# EAGLE design DCDC for Sensor 9V (EAGLE 7.6.0)
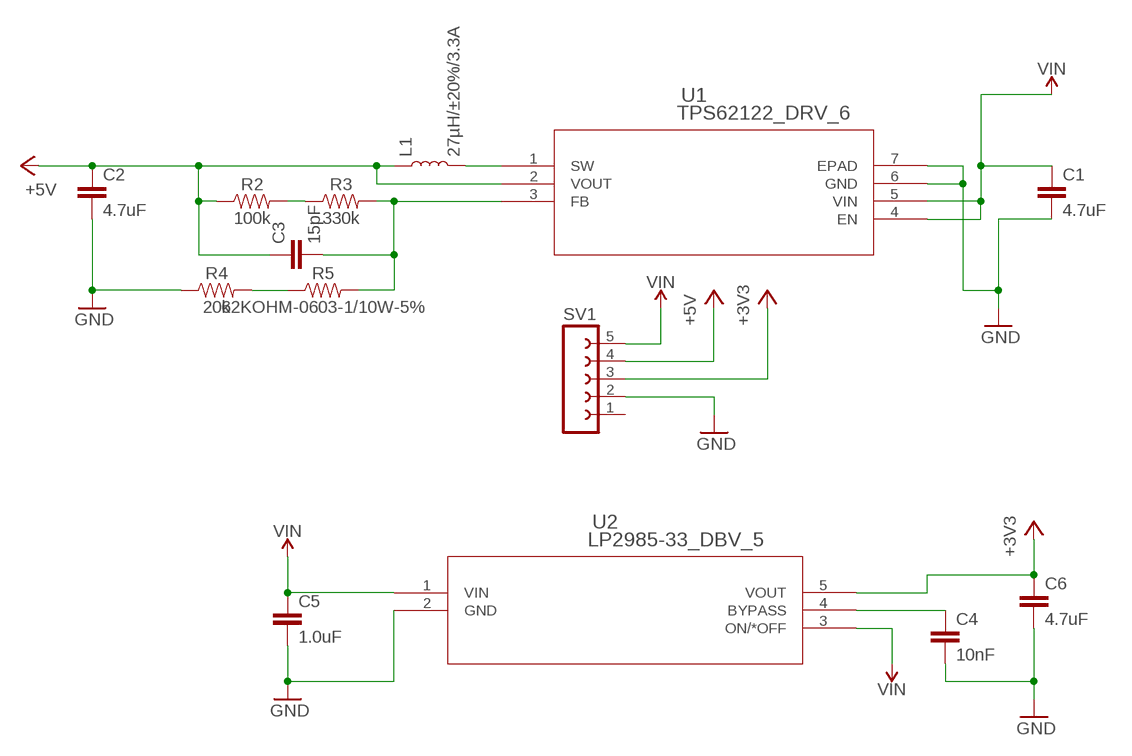
[diagram p0: schematic, sheet 1]

## Parts
C1  4.7uF  4.7UF-1206-16V-(+80/-20%)  [1206]
C2  4.7uF  4.7UF-1206-16V-(+80/-20%)  [1206]
C3  15pF  15PF-0603-50V-5%  [0603]
C4  10nF  10NF-0603-50V-10%  [0603]
C5  1.0uF  1.0UF-0603-16V-10%  [0603]
C6  4.7uF  4.7UF0603  [0603]
L1  27µH/±20%/3.3A  INDUCTOR-SDR13-27UH  [INDUCTOR_SDR1307]
R2  100k  100KOHM-0603-1/10W-1%  [0603]
R3  330k  330KOHM-0603-1/10W-1%  [0603]
R4  20k  20KOHM-0603-1/10W-5%  [0603]
R5  62KOHM-0603-1/10W-5%  [0603]
SV1  FE05-1  [FE05-1]
U1  TPS62122_DRV_6  [DRV6_1P6X1]
U2  LP2985-33_DBV_5  [DBV5]

## Nets
+3V3: C6.1 SV1.3 U2.5(VOUT)
+5V: C2.1 C3.1 L1.P$1 R2.1 SV1.4 U1.2(VOUT)
GND: C1.2 C2.2 C4.2 C5.2 C6.2 R4.1 SV1.2 U1.6(GND) U1.7(EPAD) U2.2(GND)
N$1: R4.2 R5.1
N$2: R2.2 R3.1
N$3: C4.1 U2.4(BYPASS)
N$4: L1.P$2 U1.1(SW)
N$7: C3.2 R3.2 R5.2 U1.3(FB)
VIN: C1.1 C5.1 SV1.5 U1.4(EN) U1.5(VIN) U2.1(VIN) U2.3(ON/*OFF)
Unconnected: SV1.1

## Library data of the parts
C1 C2 = SparkFun-Capacitors:4.7UF: 4.7µF ceramic capacitors A capacitor is a passive two-terminal electrical component used to store electrical energy temporarily in an electric field.; PROD_ID: CAP-10300
C3 = SparkFun-Capacitors:15PF: 15pF ceramic capacitors A capacitor is a passive two-terminal electrical component used to store electrical energy temporarily in an electric field.; PROD_ID: CAP-07881
C4 = SparkFun-Capacitors:10NF: 0.01uF/10nF/10,000pF ceramic capacitors A capacitor is a passive two-terminal electrical component used to store electrical energy temporarily in an electric field. CAP-09321; PROD_ID: CAP-00867
C5 = SparkFun-Capacitors:1.0UF: 1µF ceramic capacitors A capacitor is a passive two-terminal electrical component used to store electrical energy temporarily in an electric field.; PROD_ID: CAP-00868
C6 = SparkFun-Capacitors:4.7UF: 4.7µF ceramic capacitors A capacitor is a passive two-terminal electrical component used to store electrical energy temporarily in an electric field.; PROD_ID: CAP-08280
L1 = SparkFun-Coils:INDUCTOR: Inductors Resist changes in electrical current. Basically a coil of wire. SparkFun Products: SparkFun Load Cell Amplifier - HX711 <https://www.sparkfun.com/products/13879> IOIO-OTG - V2.2 <https://www.sparkfun.com/products/13613>; PROD_ID: NDUC-12529
R2 = SparkFun-Resistors:100KOHM: 100kΩ resistor A resistor is a passive two-terminal electrical component that implements electrical resistance as a circuit element. Resistors act to reduce current flow, and, at the same time, act to lower voltage levels within circuits. - Wikipedia; PROD_ID: RES-07828
R3 = SparkFun-Resistors:330KOHM: 330kΩ resistor A resistor is a passive two-terminal electrical component that implements electrical resistance as a circuit element. Resistors act to reduce current flow, and, at the same time, act to lower voltage levels within circuits. - Wikipedia; PROD_ID: RES-08968
R4 = SparkFun-Resistors:20KOHM: 20kΩ resistor A resistor is a passive two-terminal electrical component that implements electrical resistance as a circuit element. Resistors act to reduce current flow, and, at the same time, act to lower voltage levels within circuits. - Wikipedia; PROD_ID: RES-09231
R5 = SparkFun-Resistors:62KOHM: 62kΩ resistor A resistor is a passive two-terminal electrical component that implements electrical resistance as a circuit element. Resistors act to reduce current flow, and, at the same time, act to lower voltage levels within circuits. - Wikipedia
SV1 = con-lsta:FE05-1: FEMALE HEADER; OC_FARNELL: unknown; OC_NEWARK: unknown
U1 = TPS62122:TPS62122_DRV_6; DATASHEETURL: httpwww.ti.comlitgpnTPS62122; FAMILY_NAME: STEPDOWN REGULATOR; GENERIC_PART_NUMBER: TPS62122; INDUSTRY_STD_PKG_TYPE: SON; MANUFACTURER: Texas Instruments; MANUFACTURER_PART_NUMBER: tps62122_drv_6; PACKAGE_DESIGNATOR: DRV; PIN_COUNT: 6; VENDOR: Texas Instruments
U2 = LP298533:LP2985-33_DBV_5; DATASHEETURL: httpwww.ti.comlitgpnLP298533; FAMILY_NAME: SINGLE CHANNEL LDO; GENERIC_PART_NUMBER: LP298533; INDUSTRY_STD_PKG_TYPE: SOT23; MANUFACTURER: Texas Instruments; MANUFACTURER_PART_NUMBER: lp298533_dbv_5; PACKAGE_DESIGNATOR: DBV; PIN_COUNT: 5; VENDOR: Texas Instruments

## Board
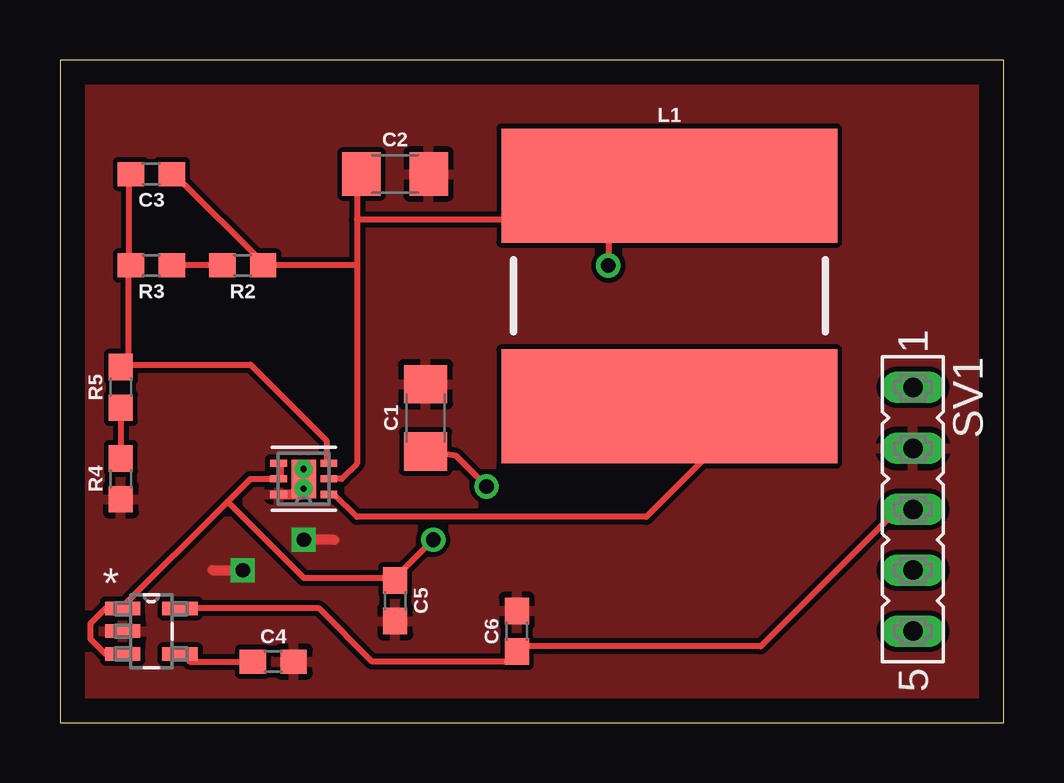
[diagram p1: board, top side]
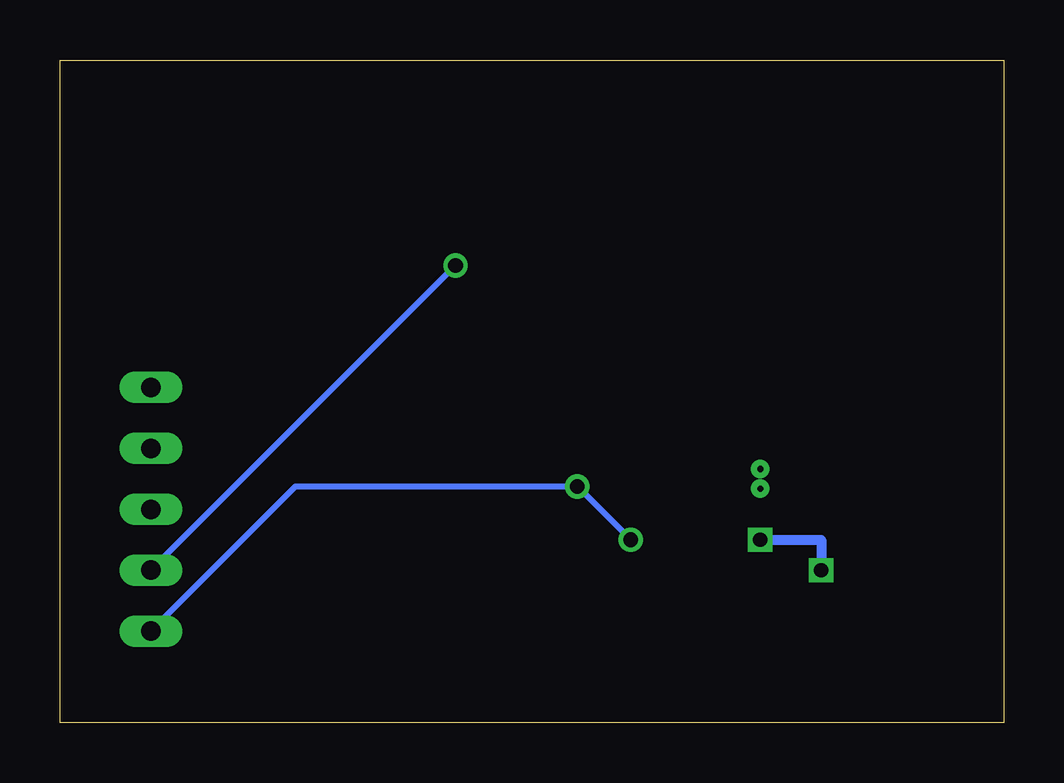
[diagram p2: board, bottom side, seen from below]

Size 39.35 x 27.61 mm. Coordinates in mm from the lower left corner, seen from the top.
Outline: 0,0 39.35,0 39.35,27.61 0,27.61 0,0
Copper layers (1*16): Top 0.035mm / dielectric 1.5mm / Bottom 0.035mm
Design rules "default": minimum track width 10mil, minimum drill 24mil, track to track 8mil, track to pad 8mil, pad to pad 8mil, via to via 8mil, smd to smd 8mil, copper to edge 40mil, drill to drill 8mil, minimum pad ring 10mil, minimum via ring 8mil, stop-mask expansion 4mil, vias tented up to drill 0mil, thermal gap 10mil

### Footprints (pad centres in the part's own frame; a part is rotated, then mirrored left to right if it is on the bottom)
1206 = smd 1.6 x 1.8: 1 -1.4,0; 2 1.4,0
0603 = smd 1.1 x 1: 1 -0.85,0; 2 0.85,0
INDUCTOR_SDR1307 = smd 14 x 4.75: P$1 0,4.6; P$2 0,-4.6
FE05-1 = drill 0.813 long: 1 -5.08,0; 2 -2.54,0; 3 0,0; 4 2.54,0; 5 5.08,0
DRV6_1P6X1 = smd 0.7 x 0.3: 1 -1.05,0.65; 2 -1.05,0; 3 -1.05,-0.65; 4 1.05,-0.65; 5 1.05,0; 6 1.05,0.65 | smd 1.016 x 1.6: 7 0,0 | drill 0.254 pad 0.508: V 0,-0.406; V_1 0,0.406
DBV5 = smd 1.473 x 0.559: 1 -1.194,0.95; 2 -1.194,0; 3 -1.194,-0.95; 4 1.194,-0.95; 5 1.194,0.95

### Placement (x,y rotation side)
C1  15.24,12.7 90 top
C2  13.97,22.86 0 top
C3  3.81,22.86 180 top
C4  8.89,2.54 0 top
C5  13.97,5.08 270 top
C6  19.05,3.81 90 top
L1  25.4,17.78 0 top
R2  7.62,19.05 180 top
R3  3.81,19.05 180 top
R4  2.54,10.16 90 top
R5  2.54,13.97 90 top
SV1  35.56,8.89 270 top
U1  10.16,10.16 180 top
U2  3.81,3.81 0 top

### Tracks (layer width: path | path; a pad name or v marks a point on that pad's centre or on a via)
+3V3
  Top 0.254: SV1.3 34.92,8.89 29.21,3.17 19.05,3.17 C6.1 19.05,2.86 18.73,2.54 13.02,2.54 10.79,4.76 5.08,4.76 U2.5
+5V  (via drill 0.61)
  Top 0.254: U1.2 11.75,10.16 12.38,10.79 12.38,19.05 | 12.38,20.95 12.38,22.86 C2.1 | 12.38,20.95 12.38,19.05 | 12.38,19.05 8.57,19.05 | 8.57,19.05 4.76,22.86 C3.1 | 8.57,19.05 R2.1 | 22.86,20.95 27.94,20.95 29.21,22.23 L1.P$1 22.86,20.95 | 22.86,20.95 12.38,20.95 | 22.86,20.95 v22.86,19.05
  Bottom 0.254: v22.86,19.05 SV1.4
GND  (via drill 0.6)
  Top 0.406: U1.6 10.16,9.51 U1.7 | 6.35,6.35 v7.62,6.35 | 11.43,7.62 v10.16,7.62
  Bottom 0.406: v10.16,7.62 7.62,7.62 v7.62,6.35
  pour Top: 0,29.21 0,-1.27 40.64,-1.27 40.64,2.54 39.37,2.54 39.37,29.21
N$1
  Top 0.254: R5.1 R4.2
N$2
  Top 0.254: R2.2 R3.1
N$3
  Top 0.254: C4.1 5.4,2.54 5.08,2.86 U2.4
N$4
  Top 0.254: U1.1 11.43,9.53 12.38,8.57 24.45,8.57 29.21,13.34 L1.P$2
N$7
  Top 0.254: 2.86,19.05 2.86,22.86 C3.2 | 2.86,14.92 2.54,14.92 R5.2 2.86,14.92 | 2.86,14.92 7.94,14.92 11.11,11.75 11.11,10.79 U1.3 | 2.86,14.92 2.86,19.05 | 2.86,19.05 R3.2
VIN  (via drill 0.61)
  Top 0.254: U1.4 9.21,10.79 9.21,10.16 U1.5 7.94,10.16 6.99,9.21 | 2.54,4.76 6.99,9.21 | 13.97,6.03 10.16,6.03 6.99,9.21 | 2.54,4.76 1.91,4.76 1.27,4.13 1.27,3.49 1.91,2.86 2.54,2.86 U2.3 | 2.54,4.76 U2.1 | v17.78,9.84 16.51,11.11 C1.1 | v15.56,7.62 13.97,6.03 | 13.97,6.03 C5.1
  Bottom 0.254: SV1.5 29.53,9.84 v17.78,9.84 v15.56,7.62